# EAGLE schematic GPS (EAGLE 9.6.2)
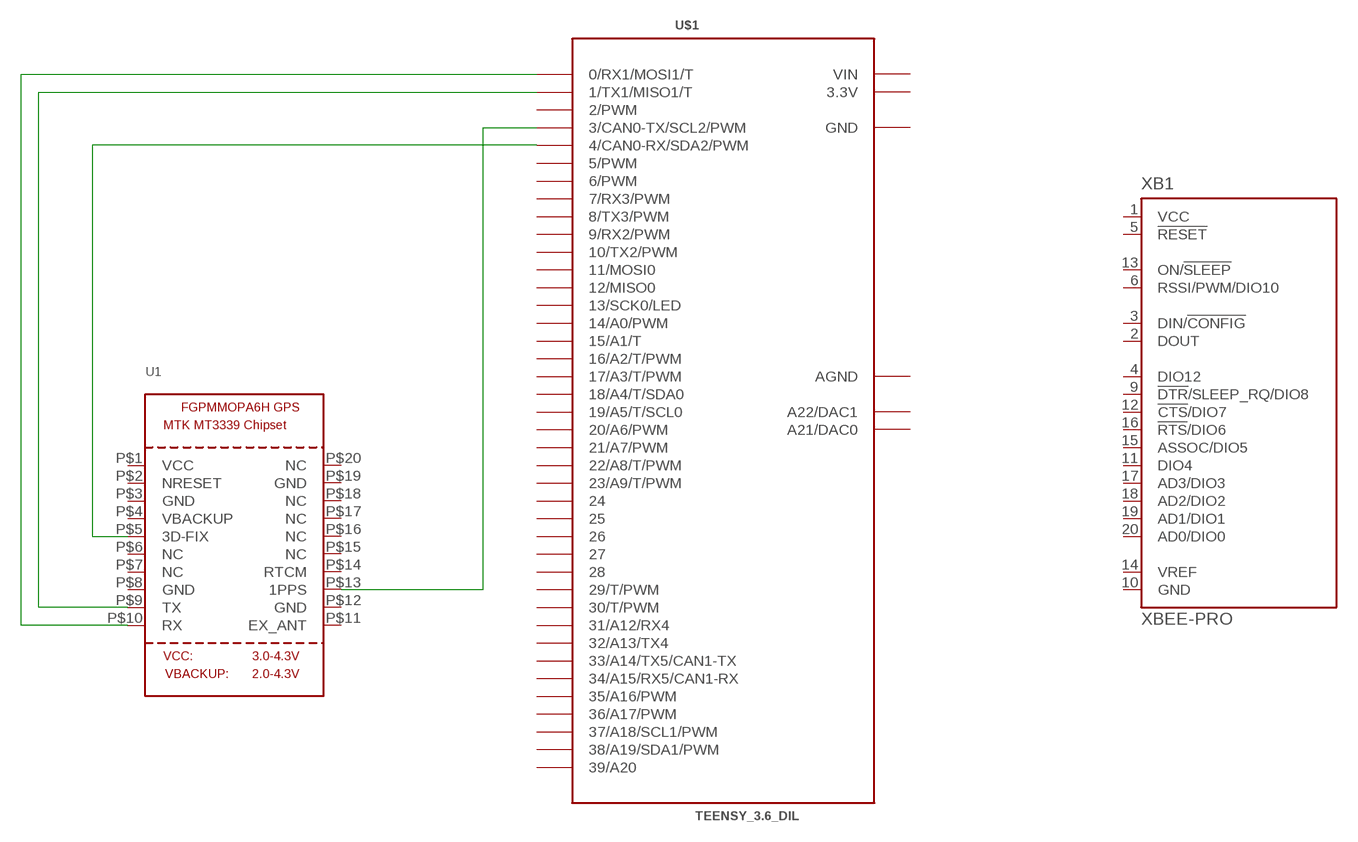
[diagram p0: schematic, sheet 1]

## Parts
U1  GPS_FGPMMOPA6H  [FGPMMOPA6H]
U$1  TEENSY_3.6_DIL  [TEENSY_3.6_DIL]
XB1  XBEE-PRO  [XBEE-PRO]

## Nets
N$1: U1.P$9(TX) U$1.1(1/TX1/MISO1/T)
N$2: U1.P$10(RX) U$1.0(0/RX1/MOSI1/T)
N$3: U1.P$5(3D-FIX) U$1.4(4/CAN0-RX/SDA2/PWM)
N$4: U1.P$13(1PPS) U$1.3(3/CAN0-TX/SCL2/PWM)
Unconnected: U1.P$1(VCC) U1.P$2(NRESET) U1.P$3(GND) U1.P$4(VBACKUP) U1.P$6(NC) U1.P$7(NC) U1.P$8(GND) U1.P$11(EX_ANT) U1.P$12(GND) U1.P$14(RTCM) U1.P$15(NC) U1.P$16(NC) U1.P$17(NC) U1.P$18(NC) U1.P$19(GND) U1.P$20(NC) U$1.2(2/PWM) U$1.5(5/PWM) U$1.6(6/PWM) U$1.7(7/RX3/PWM) U$1.8(8/TX3/PWM) U$1.9(9/RX2/PWM) U$1.10(10/TX2/PWM) U$1.11(11/MOSI0) U$1.12(12/MISO0) U$1.13(13/SCK0/LED) U$1.14/A0(14/A0/PWM) U$1.15/A1(15/A1/T) U$1.16/A2(16/A2/T/PWM) U$1.17/A3(17/A3/T/PWM) U$1.18/A4(18/A4/T/SDA0) U$1.19/A5(19/A5/T/SCL0) U$1.20/A6(20/A6/PWM) U$1.21/A7(21/A7/PWM) U$1.22/A8(22/A8/T/PWM) U$1.23/A9(23/A9/T/PWM) U$1.24 U$1.25 U$1.26 U$1.27 U$1.28 U$1.29(29/T/PWM) U$1.30(30/T/PWM) U$1.31/A12(31/A12/RX4) U$1.32/A13(32/A13/TX4) U$1.33/A14(33/A14/TX5/CAN1-TX) U$1.34/A15(34/A15/RX5/CAN1-RX) U$1.35/A16(35/A16/PWM) U$1.36/A17(36/A17/PWM) U$1.37/A18(37/A18/SCL1/PWM) U$1.38/A19(38/A19/SDA1/PWM) U$1.39/A20 U$1.A21(A21/DAC0) U$1.A22(A22/DAC1) XB1.2(DOUT) XB1.3(DIN/!CONFIG) XB1.4(DIO12) XB1.5(!RESET) XB1.6(RSSI/PWM/DIO10) XB1.9(!DTR!/SLEEP_RQ/DIO8) XB1.11(DIO4) XB1.12(!CTS!/DIO7) XB1.13(ON/!SLEEP) XB1.14(VREF) XB1.15(ASSOC/DIO5) XB1.16(!RTS!/DIO6) XB1.17(AD3/DIO3) XB1.18(AD2/DIO2) XB1.19(AD1/DIO1) XB1.20(AD0/DIO0)

## Power pins joined to a net without a drawn wire
3.3V: U$1.3.3V U$1.3.3V3(3.3V)
AGND: U$1.AGND
GND: U$1.GND U$1.GND1(GND) XB1.10(GND)
VCC: XB1.1(VCC)
VIN: U$1.VIN

## Library data of the parts
U1 = adafruit:GPS_FGPMMOPA6H: GPS Module - MTK MT3339 Chipset, -165dBm sensitivity, 22 channels, 10Hz, auto-select external antenna options
U$1 = Teensy_3_and_LC_Series_Boards_v1.4:TEENSY_3.6_DIL: Teensy 3.6 DIL Package
XB1 = xbee:XBEE: XBee (TM) /XBee-PRO(TM) OEM RF Modules Source: MaxStream, Inc. xbee_productmanual.pdf; MPN: XBP24-AWI-001; OC_FARNELL: 1337916; OC_NEWARK: 42M2667